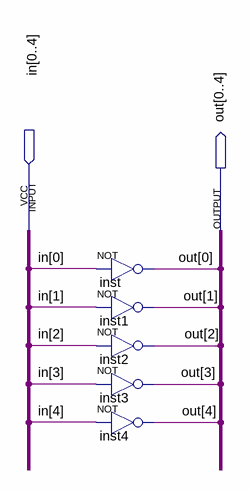
[diagram p0: schematic sheet]
// Quartus schematic not5.bdf as structural Verilog: 5 symbols, 2 pins
module not5 (
  input  [0:4] in,
  output [0:4] out
);

  not inst (out[0], in[0]);
  not inst1 (out[1], in[1]);
  not inst2 (out[2], in[2]);
  not inst3 (out[3], in[3]);
  not inst4 (out[4], in[4]);
endmodule
